# EAGLE schematic pro-one-oscillators (EAGLE 5.07)
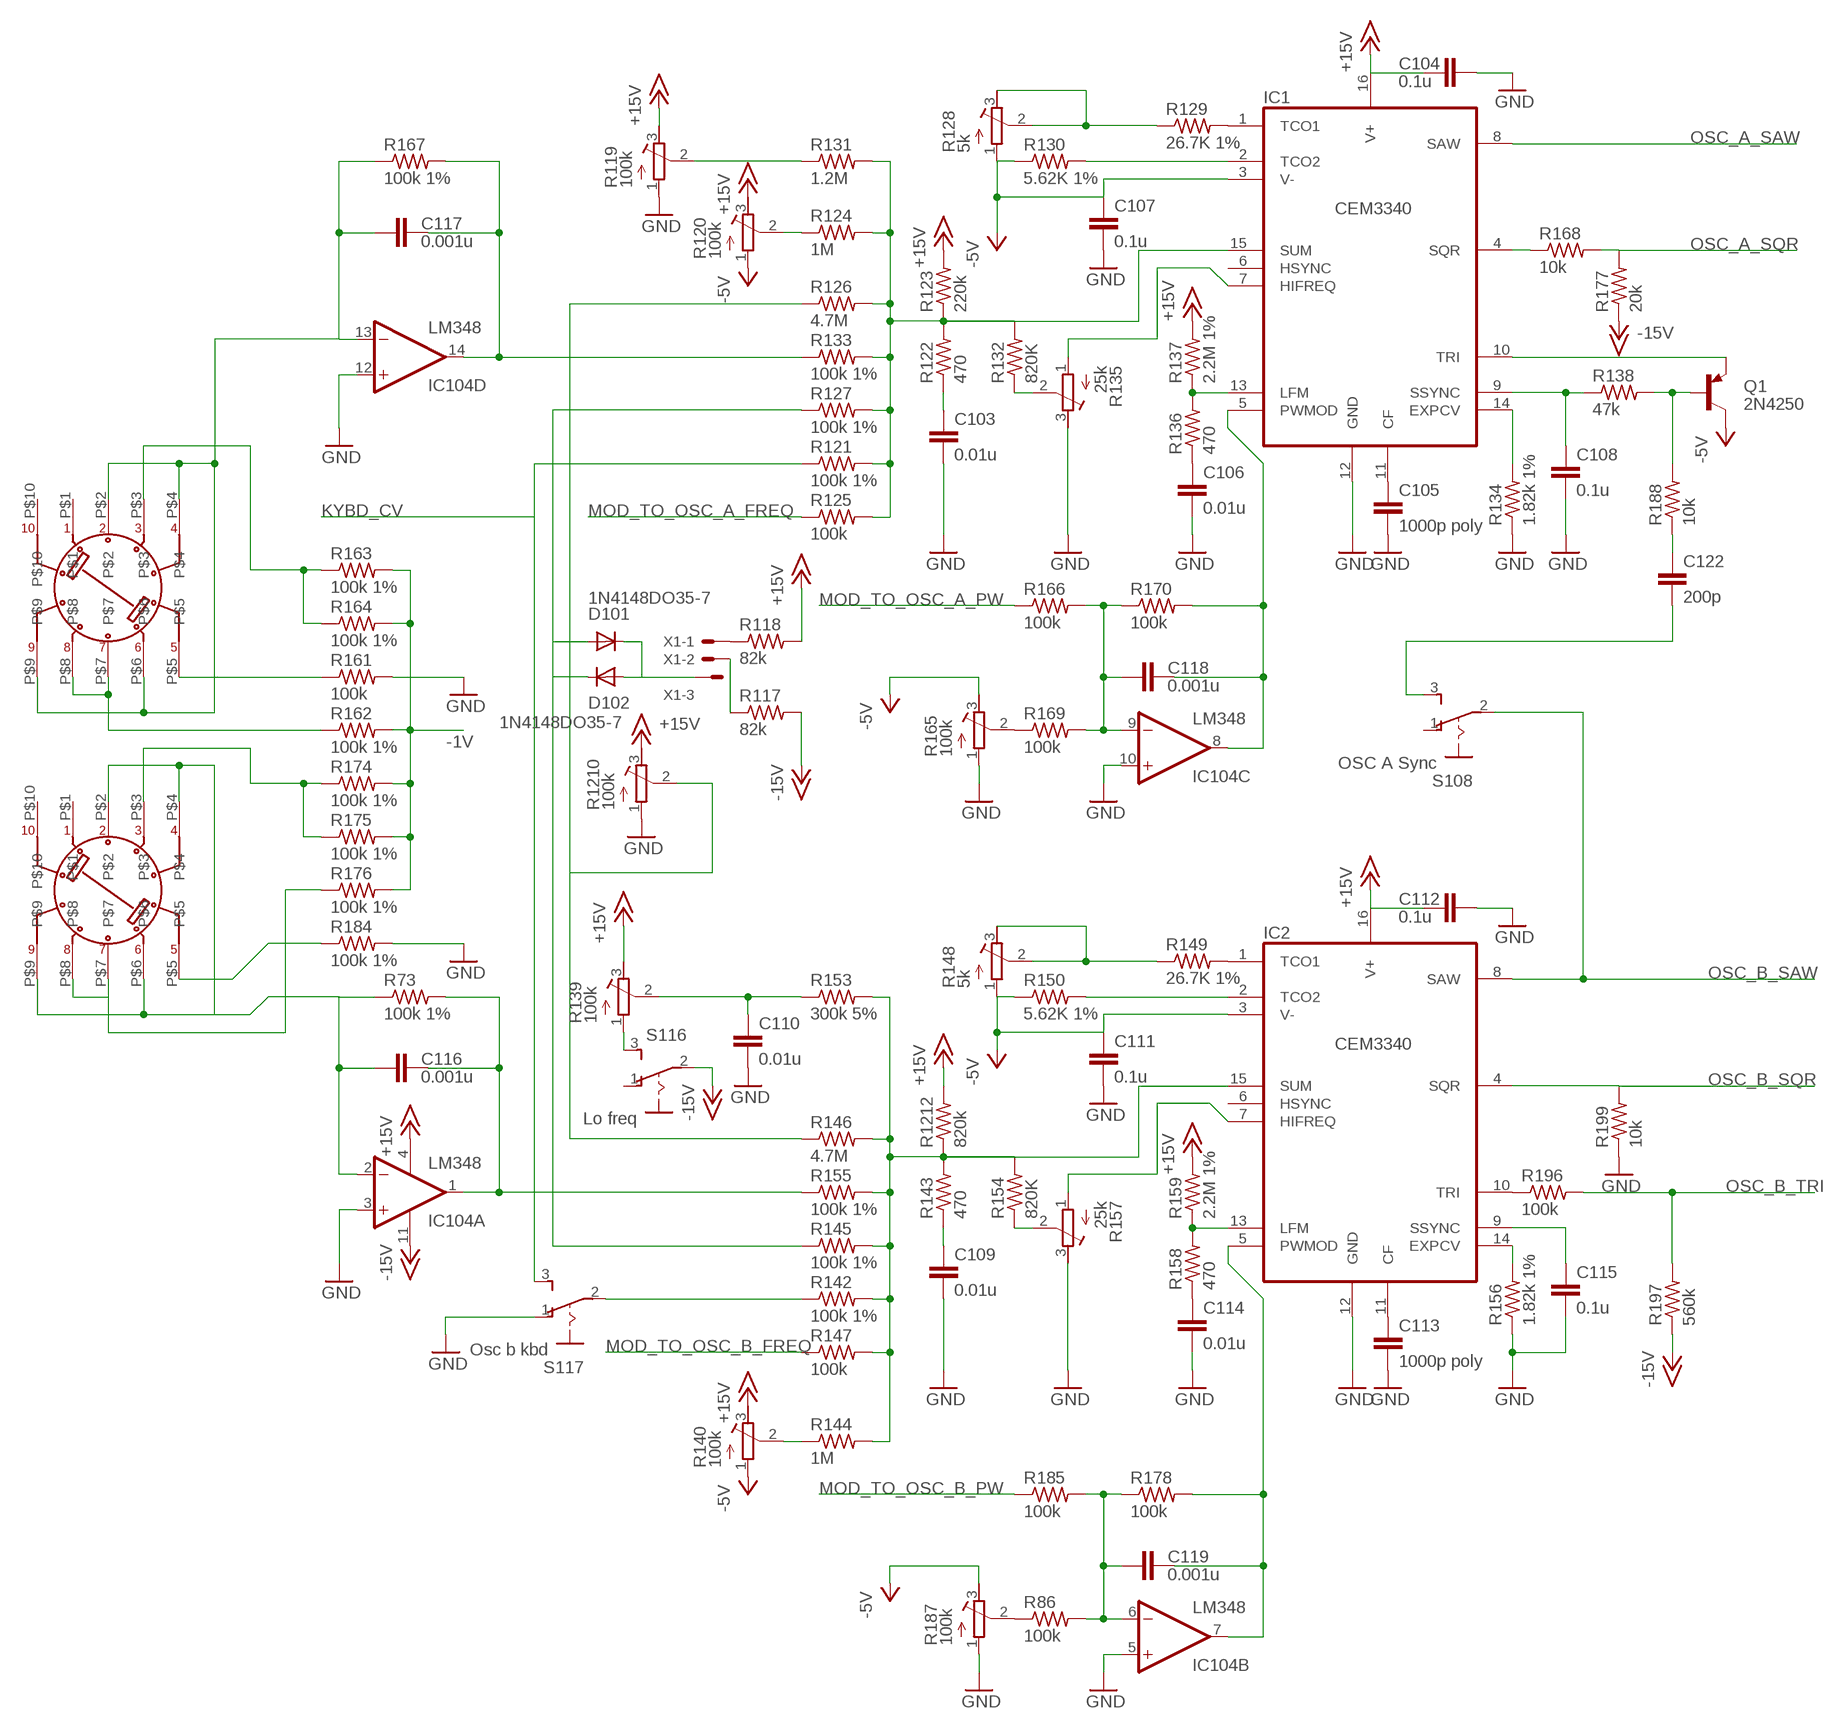
[diagram p0: schematic, sheet 1]

## Parts
C103  0.01u  C-EU050-025X075  [C050-025X075]
C104  0.1u  C-EU050-025X075  [C050-025X075]
C105  1000p poly  C-EU050-025X075  [C050-025X075]
C106  0.01u  C-EU050-025X075  [C050-025X075]
C107  0.1u  C-EU050-025X075  [C050-025X075]
C108  0.1u  C-EU050-025X075  [C050-025X075]
C109  0.01u  C-EU050-025X075  [C050-025X075]
C110  0.01u  C-EU050-025X075  [C050-025X075]
C111  0.1u  C-EU050-025X075  [C050-025X075]
C112  0.1u  C-EU050-025X075  [C050-025X075]
C113  1000p poly  C-EU050-025X075  [C050-025X075]
C114  0.01u  C-EU050-025X075  [C050-025X075]
C115  0.1u  C-EU050-025X075  [C050-025X075]
C116  0.001u  C-EU050-025X075  [C050-025X075]
C117  0.001u  C-EU050-025X075  [C050-025X075]
C118  0.001u  C-EU050-025X075  [C050-025X075]
C119  0.001u  C-EU050-025X075  [C050-025X075]
C122  200p  C-EU050-025X075  [C050-025X075]
D101  1N4148DO35-7  [DO35-7]
D102  1N4148DO35-7  [DO35-7]
IC1  CEM3340  [DIL16]
IC2  CEM3340  [DIL16]
IC104  LM348  [DIL14]
Q1  2N4250  [TO92]
R73  100k 1%  R-US_0309/10  [0309/10]
R86  100k  R-US_0309/10  [0309/10]
R117  82k  R-US_0309/10  [0309/10]
R118  82k  R-US_0309/10  [0309/10]
R119  100k  R-TRIMM64W  [RTRIM64W]
R120  100k  R-TRIMM64W  [RTRIM64W]
R121  100k 1%  R-US_0309/10  [0309/10]
R122  470  R-US_0309/10  [0309/10]
R123  220k  R-US_0309/10  [0309/10]
R124  1M  R-US_0309/10  [0309/10]
R125  100k  R-US_0309/10  [0309/10]
R126  4.7M  R-US_0309/10  [0309/10]
R127  100k 1%  R-US_0309/10  [0309/10]
R128  5k  R-TRIMM64W  [RTRIM64W]
R129  26.7K 1%  R-US_0309/10  [0309/10]
R130  5.62K 1%  R-US_0309/10  [0309/10]
R131  1.2M  R-US_0309/10  [0309/10]
R132  820K  R-US_0309/10  [0309/10]
R133  100k 1%  R-US_0309/10  [0309/10]
R134  1.82k 1%  R-US_0309/10  [0309/10]
R135  25k  R-TRIMM64W  [RTRIM64W]
R136  470  R-US_0309/10  [0309/10]
R137  2.2M 1%  R-US_0309/10  [0309/10]
R138  47k  R-US_0309/10  [0309/10]
R139  100k  R-TRIMM64W  [RTRIM64W]
R140  100k  R-TRIMM64W  [RTRIM64W]
R142  100k 1%  R-US_0309/10  [0309/10]
R143  470  R-US_0309/10  [0309/10]
R144  1M  R-US_0309/10  [0309/10]
R145  100k 1%  R-US_0309/10  [0309/10]
R146  4.7M  R-US_0309/10  [0309/10]
R147  100k  R-US_0309/10  [0309/10]
R148  5k  R-TRIMM64W  [RTRIM64W]
R149  26.7K 1%  R-US_0309/10  [0309/10]
R150  5.62K 1%  R-US_0309/10  [0309/10]
R153  300k 5%  R-US_0309/10  [0309/10]
R154  820K  R-US_0309/10  [0309/10]
R155  100k 1%  R-US_0309/10  [0309/10]
R156  1.82k 1%  R-US_0309/10  [0309/10]
R157  25k  R-TRIMM64W  [RTRIM64W]
R158  470  R-US_0309/10  [0309/10]
R159  2.2M 1%  R-US_0309/10  [0309/10]
R161  100k  R-US_0309/10  [0309/10]
R162  100k 1%  R-US_0309/10  [0309/10]
R163  100k 1%  R-US_0309/10  [0309/10]
R164  100k 1%  R-US_0309/10  [0309/10]
R165  100k  R-TRIMM64W  [RTRIM64W]
R166  100k  R-US_0309/10  [0309/10]
R167  100k 1%  R-US_0309/10  [0309/10]
R168  10k  R-US_0309/10  [0309/10]
R169  100k  R-US_0309/10  [0309/10]
R170  100k  R-US_0309/10  [0309/10]
R174  100k 1%  R-US_0309/10  [0309/10]
R175  100k 1%  R-US_0309/10  [0309/10]
R176  100k 1%  R-US_0309/10  [0309/10]
R177  20k  R-US_0309/10  [0309/10]
R178  100k  R-US_0309/10  [0309/10]
R184  100k 1%  R-US_0309/10  [0309/10]
R185  100k  R-US_0309/10  [0309/10]
R187  100k  R-TRIMM64W  [RTRIM64W]
R188  10k  R-US_0309/10  [0309/10]
R196  100k  R-US_0309/10  [0309/10]
R197  560k  R-US_0309/10  [0309/10]
R199  10k  R-US_0309/10  [0309/10]
R1210  100k  R-TRIMM64W  [RTRIM64W]
R1212  820k  R-US_0309/10  [0309/10]
S1  R204XXRX02  [RXXXRX02]
S105  R204XXRX02  [RXXXRX02]
S108  OSC A Sync  255SB  [255SB]
S116  Lo freq  255SB  [255SB]
S117  Osc b kbd  255SB  [255SB]
X1  22-23-2031  [22-23-2031]

## Nets
+15V: C104.1 C112.1 IC1.16(V+) IC2.16(V+) IC104.4(P:V+) R118.2 R119.3(A) R120.3(A) R123.2 R137.2 R139.3(A) R140.3(A) R159.2 R1210.3(A) R1212.2
-1V: R162.2 R163.2 R164.2 R174.2 R175.2 R176.2
-5V: C107.1 C111.1 IC1.3(V-) IC2.3(V-) Q1.1(C) R120.1(E) R128.1(E) R130.1 R140.1(E) R148.1(E) R150.1 R165.3(A) R187.3(A)
-15V: IC104.11(P:V-) R117.2 R177.1 R197.1 S116.2(P)
GND: C103.2 C104.2 C105.2 C106.2 C107.2 C108.2 C109.2 C110.2 C111.2 C112.2 C113.2 C114.2 C115.2 IC1.12(GND) IC2.12(GND) IC104.3(A:+IN) IC104.5(B:+IN) IC104.10(C:+IN) IC104.12(D:+IN) R119.1(E) R134.1 R135.3(A) R156.1 R157.3(A) R161.2 R165.1(E) R184.2 R187.1(E) R199.1 R1210.1(E) S117.1(O)
KYBD_CV: R121.1 S117.3(S)
MOD_TO_OSC_A_FREQ: R125.1
MOD_TO_OSC_A_PW: R166.1
MOD_TO_OSC_B_FREQ: R147.1
MOD_TO_OSC_B_PW: R185.1
N$1: IC1.1(TCO1) R129.2
N$2: IC1.2(TCO2) R130.2
N$3: IC1.13(LFM) R136.2 R137.1
N$4: IC1.15(SUM) R122.2 R123.1 R132.2
N$5: R128.2(S) R128.3(A) R129.1
N$6: C106.1 R136.1
N$7: C108.1 IC1.9(SSYNC) R138.1
N$8: IC1.7(HIFREQ) R135.1(E)
N$9: R132.1 R135.2(S)
N$10: C103.1 R122.1
N$11: C105.1 IC1.11(CF)
N$12: IC1.14(EXPCV) R134.2
N$13: IC1.4(SQR) R168.1
N$14: R168.2 R177.2
N$15: IC2.1(TCO1) R149.2
N$16: IC2.2(TCO2) R150.2
N$17: IC2.13(LFM) R158.2 R159.1
N$18: R139.1(E) S116.3(S)
N$19: R148.2(S) R148.3(A) R149.1
N$20: IC2.7(HIFREQ) R157.1(E)
N$21: R154.1 R157.2(S)
N$22: C114.1 R158.1
N$23: C109.1 R143.1
N$24: IC2.14(EXPCV) R156.2
N$25: IC2.4(SQR)
N$26: C116.1 IC104.2(A:-IN) R73.1 S1.P$2 S1.P$4 S1.P$6 S1.P$9
N$27: C115.1 IC2.9(SSYNC)
N$28: C113.1 IC2.11(CF)
N$29: R126.1 R146.1 R1210.2(S)
N$30: R140.2(S) R144.1
N$31: D101.A D102.C R127.1 R145.1
N$32: C110.1 R139.2(S) R153.1
N$33: R165.2(S) R169.1
N$34: C118.2 IC1.5(PWMOD) IC104.8(C:OUT) R170.2
N$35: R121.2 R124.2 R125.2 R126.2 R127.2 R131.2 R133.2
N$36: C118.1 IC104.9(C:-IN) R166.2 R169.2 R170.1
N$37: R86.1 R187.2(S)
N$38: C119.1 IC104.6(B:-IN) R86.2 R178.1 R185.2
N$39: C119.2 IC2.5(PWMOD) IC104.7(B:OUT) R178.2
N$40: C116.2 IC104.1(A:OUT) R73.2 R155.1
N$41: IC2.15(SUM) R142.2 R143.2 R144.2 R145.2 R146.2 R147.2 R153.2 R154.2 R155.2 R1212.1
N$42: R142.1 S117.2(P)
N$43: R120.2(S) R124.1
N$45: D101.C D102.A X1.3
N$46: C117.2 IC104.14(D:OUT) R133.1 R167.2
N$47: C117.1 IC104.13(D:-IN) R167.1 S105.P$2 S105.P$4 S105.P$6 S105.P$9
N$48: R118.1 X1.1
N$49: R117.1 X1.2
N$50: R119.2(S) R131.1
N$51: R163.1 R164.1 S105.P$3
N$52: Q1.2(B) R138.2 R188.2
N$54: IC1.10(TRI) Q1.3(E)
N$55: R174.1 R175.1 S1.P$3
N$56: R161.1 S105.P$5
N$59: R184.1 S1.P$5
N$60: R176.1 S1.P$7 S1.P$8
N$61: C122.1 R188.1
N$62: C122.2 S108.3(S)
N$63: R162.1 S105.P$7 S105.P$8
N$64: IC2.10(TRI) R196.1
OSC_A_SAW: IC1.8(SAW)
OSC_B_SAW: IC2.8(SAW) S108.2(P)
OSC_B_SQR: R199.2
OSC_B_TRI: R196.2 R197.2
Unconnected: IC1.6(HSYNC) IC2.6(HSYNC) S1.P$1 S1.P$10 S105.P$1 S105.P$10 S108.1(O) S116.1(O)

## Library data of the parts
C103-C119 C122 = resistor:C-EU: CAPACITOR, European symbol
D101 D102 = diode:1N4148: DIODE high speed (Philips)
IC1 IC2 = joakim:CEM3340: Voltage Controlled Oscillator for musical synthesizers
IC104 = joakim:LM348: Quad General Purpose, Low Voltage, Operational Amplifiers
Q1 = joakim:2N4250: PNP Transistor
R73 R86 R117 R118 R121-R127 R129-R134 R136-R138 R142-R147 R149 R150 R153-R156 R158 R159 R161-R164 R166-R170 R174-R178 R184 R185 R188 R196 R197 R199 R1212 = resistor:R-US_: RESISTOR, American symbol
R119 R120 R128 R135 R139 R140 R148 R157 R165 R187 R1210 = resistor:R-TRIMM: Trimm resistor
S1 S105 = joakim:R204XXRX02: 4 position, DP, 36 degrees rotary switch, C & K R Series ROTA-SLIDE
S108 S116 S117 = switch:255SB: SLIDING SWITCH Distributor Buerklin, 11G810
X1 = con-molex:22-23-2031: .100" (2.54mm) Center Header - 3 Pin